# EAGLE design headphone-amp (EAGLE 9.6.2)
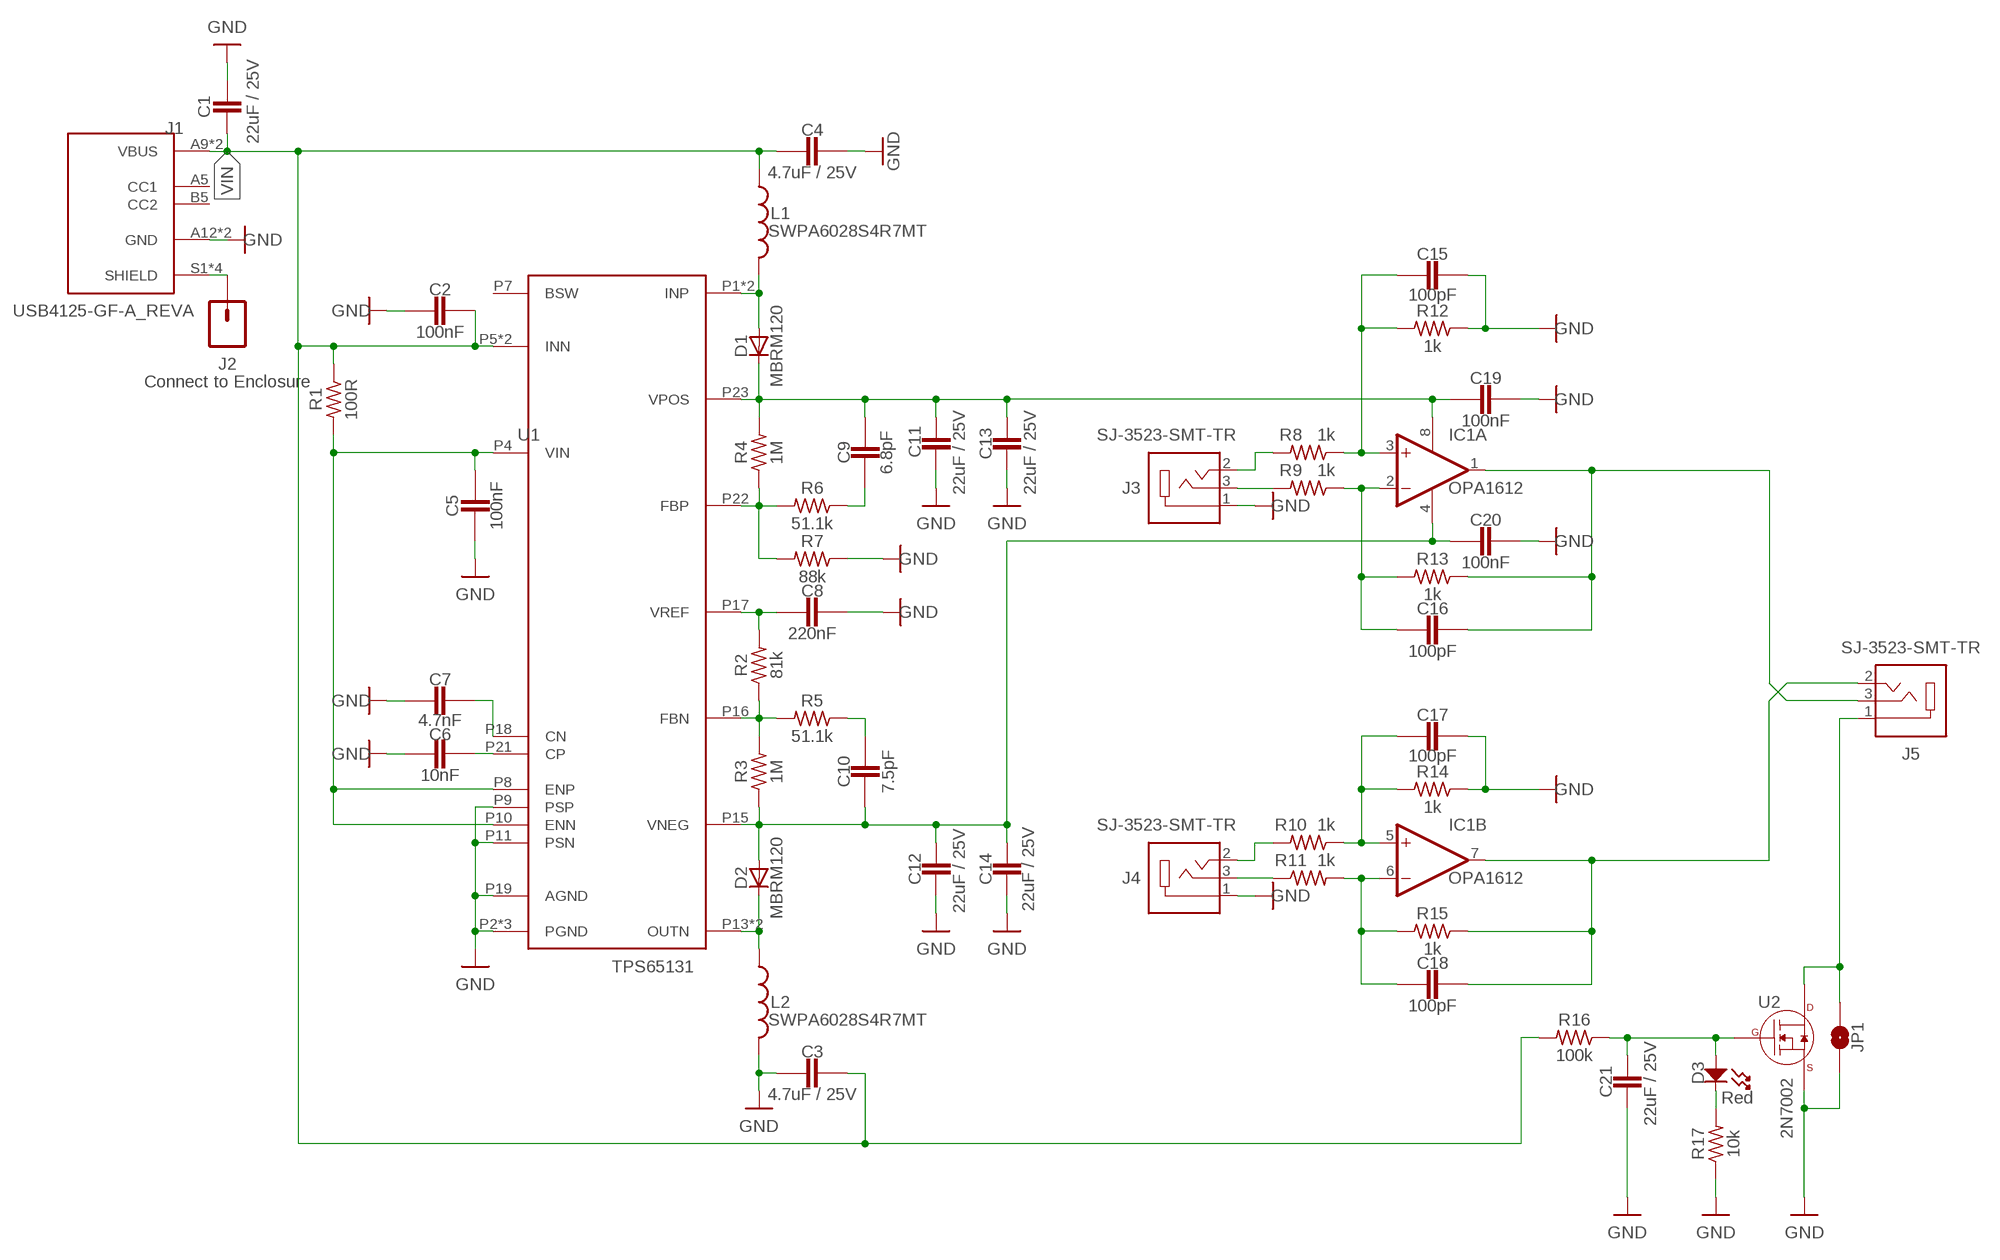
[diagram p0: schematic, sheet 1]

## Parts
C1  22uF / 25V  C-EUC0805  [C0805]
C2  100nF  CAPACITOR-0402  [C0402]
C3  4.7uF / 25V  CAPACITOR-0402  [C0402]
C4  4.7uF / 25V  CAPACITOR-0402  [C0402]
C5  100nF  CAPACITOR-0402  [C0402]
C6  10nF  CAPACITOR-0402  [C0402]
C7  4.7nF  CAPACITOR-0402  [C0402]
C8  220nF  CAPACITOR-0402  [C0402]
C9  6.8pF  CAPACITOR-0402  [C0402]
C10  7.5pF  CAPACITOR-0402  [C0402]
C11  22uF / 25V  C-EUC0805  [C0805]
C12  22uF / 25V  C-EUC0805  [C0805]
C13  22uF / 25V  C-EUC0805  [C0805]
C14  22uF / 25V  C-EUC0805  [C0805]
C15  100pF  CAPACITOR-0402  [C0402]
C16  100pF  CAPACITOR-0402  [C0402]
C17  100pF  CAPACITOR-0402  [C0402]
C18  100pF  CAPACITOR-0402  [C0402]
C19  100nF  CAPACITOR-0402  [C0402]
C20  100nF  CAPACITOR-0402  [C0402]
C21  22uF / 25V  C-EUC0805  [C0805]
D1  MBRM120  [POWERMITE]
D2  MBRM120  [POWERMITE]
D3  Red  LED_SINGLE-0603  [LED0603]
IC1  OPA1612  OPA2134UA  [SO08]
J1  USB4125-GF-A_REVA  [GCT_USB4125-GF-A_REVA]
J2  CONN_01  [1X01]
J3  SJ-3523-SMT-TR  [CUI_SJ-3523-SMT-TR]
J4  SJ-3523-SMT-TR  [CUI_SJ-3523-SMT-TR]
J5  SJ-3523-SMT-TR  [CUI_SJ-3523-SMT-TR]
JP1  JUMPER-SMT_2_NO_SILK  [SMT-JUMPER_2_NO_SILK]
L1  SWPA6028S4R7MT  L-USWE-TPC  [POWER-CHOKE_WE-TPC]
L2  SWPA6028S4R7MT  L-USWE-TPC  [POWER-CHOKE_WE-TPC]
R1  100R  R-US_R0402  [R0402]
R2  81k  R-US_R0402  [R0402]
R3  1M  R-US_R0402  [R0402]
R4  1M  R-US_R0402  [R0402]
R5  51.1k  R-US_R0402  [R0402]
R6  51.1k  R-US_R0402  [R0402]
R7  88k  R-US_R0402  [R0402]
R8  1k  R-US_R0402  [R0402]
R9  1k  R-US_R0402  [R0402]
R10  1k  R-US_R0402  [R0402]
R11  1k  R-US_R0402  [R0402]
R12  1k  R-US_R0402  [R0402]
R13  1k  R-US_R0402  [R0402]
R14  1k  R-US_R0402  [R0402]
R15  1k  R-US_R0402  [R0402]
R16  100k  R-US_R0402  [R0402]
R17  10k  R-US_R0402  [R0402]
U1  TPS65131  [QFN24-4X4-2]
U2  2N7002  N-CHANNEL_FET_SOT-23-3  [SOT-23-3]

## Nets
GND: C1.1 C2.1 C3.2 C4.1 C5.2 C6.2 C7.2 C8.1 C11.2 C12.2 C13.2 C14.2 C15.1 C17.1 C19.2 C20.2 C21.2 J1.A12(GND) J1.B12(GND) J3.1 J4.1 JP1.1 L2.2 R7.1 R12.1 R14.1 R17.1 U1.P2(PGND) U1.P3(PGND) U1.P9(PSP) U1.P11(PSN) U1.P19(AGND) U1.PAD(PGND) U2.P$2(SOURCE)
N$1: C18.1 IC1.7(B:OUT) J5.2 R15.1
N$3: D1.P$2(A) L1.2 U1.P1(INP) U1.P24(INP)
N$4: C16.1 IC1.1(A:OUT) J5.3 R13.1
N$5: J1.S1(SHIELD) J1.S2(SHIELD) J1.S3(SHIELD) J1.S4(SHIELD) J2.1
N$6: J3.3 R9.2
N$7: R4.1 R6.2 R7.2 U1.P22(FBP)
N$8: C9.2 R6.1
N$9: C8.2 R2.2 U1.P17(VREF)
N$10: R2.1 R3.2 R5.2 U1.P16(FBN)
N$11: C10.2 R5.1
N$12: J3.2 R8.2
N$13: D2.P$1(C) L2.1 U1.P13(OUTN) U1.P14(OUTN)
N$14: C6.1 U1.P21(CP)
N$15: C7.1 U1.P18(CN)
N$16: C18.2 IC1.6(B:-IN) R11.2 R15.2
N$17: C17.2 IC1.5(B:+IN) R10.1 R14.2
N$18: J4.2 R10.2
N$19: J4.3 R11.1
N$20: D3.CATHODE R17.2
N$21: C16.2 IC1.2(A:-IN) R9.1 R13.2
N$22: C15.2 IC1.3(A:+IN) R8.1 R12.2
N$23: C5.1 R1.2 U1.P4(VIN) U1.P8(ENP) U1.P10(ENN)
N$25: J5.1 JP1.2 U2.P$3(DRAIN)
N$26: C21.1 D3.ANODE R16.1 U2.P$1(GATE)
VDD: C9.1 C11.1 C13.1 C19.1 D1.P$1(C) IC1.8(A:V+) R4.2 U1.P23(VPOS)
VEE: C10.1 C12.1 C14.1 C20.1 D2.P$2(A) IC1.4(A:V-) R3.1 U1.P15(VNEG)
VIN: C1.2 C2.2 C3.1 C4.2 J1.A9(VBUS) J1.B9(VBUS) L1.1 R1.1 R16.2 U1.P5(INN) U1.P6(INN)
Unconnected: J1.A5(CC1) J1.B5(CC2) U1.P7(BSW)

## Notes on the sheet
- Connect to Enclosure

## Library data of the parts
C1 C11-C14 C21 = rcl:C-EU: CAPACITOR, European symbol; SPICEPREFIX: C
C2-C10 C15-C20 = Components:CAPACITOR
D1 D2 = sonik:MBRM120
D3 = MF_LEDs:LED_SINGLE: Library: MF_LEDs Description: Device for Single LED Packages. Manufacture part number (MFG#) can be added via Attributes.; HOUSEPART: NO; POPULATE: 1
IC1 = linear:OPA2*: Dual Operational Amplifier Low Power, Single-Supply, Rail-To-Rail Operational Amplifier Source: http://focus.ti.com/lit/ds/symlink/opa2345.pdf http://focus.ti.com .. opa241.pdf http://focus.ti.com/lit/ds/symlink/opa2134.pdf
J1 = USB4125-GF-A_REVA:USB4125-GF-A_REVA: USB 2.0 Type C Receptacle, Horizontal, SMT, For Power charging; DESCRIPTION: USB Charge Only Connector Type C Horizontal Receptacle, 3.16mm profile, 6 Pins, Surface mount, Top mount, low cost; MF: Global Connector Technology; MP: USB4125-GF-A; PACKAGE: None; PURCHASE-URL: https://pricing.snapeda.com/search/part/USB4125-GF-A/?ref=eda
J2 = SparkFun-Connectors:CONN_01: Single connection point. Often used as Generic Header-pin footprint for 0.1 inch spaced/style header connections On any of the 0.1 inch spaced packages, you can populate with these: Break Away Headers - Straight <https://www.sparkfun.com/products/116> (PRT-00116) Break Away Male Headers - Right Angle <https://www.sparkfun.com/products/553> (PRT-00553) Female Headers <https://www.sparkfun.com/products/115> (PRT-00115) Break Away Headers - Machine Pin <https://www.sparkfun.com/products/117> (PRT-00117) Break Away Female Headers - Swiss Machine Pin <https://www.sparkfun.com/products/743> (PRT-00743) This device is also useful as a general connection point to wire up your design to another part of your project. Our various solder wires solder well into these plated through hole pads. Hook-Up Wire - Assortment (Stranded, 22 AWG) <https://www.sparkfun.com/products/11375> (PRT-11375) Hook-Up Wire - Assortment (Solid Core, 22 AWG) <https://www.sparkfun.com/products/11367> (PRT-11367) View the entire wire category on our website here <https://www.sparkfun.com/categories/141> Special notes: SMTSO-256-ET is a "flush mount" nut for a 4-40 screw. We mostly use this on specialty testbeds; it is a nice way to connect hardware to your PCB at an adjustable hieght. Also note, the SNAP packages are for using a snappable style connector. We sell a baggie of snaps and they are also used on two LilyPad designs: Snap Assortment - 30 pack (male and female) <https://www.sparkfun.com/products/11347> (DEV-11347) LilyPad Arduino SimpleSnap <https://www.sparkfun.com/products/10941> (DEV-10941) LilyPad SimpleSnap Protoboard <https://www.sparkfun.com/products/10940> (DEV-10940)
J3-J5 = SJ-3523-SMT-TR:SJ-3523-SMT-TR: Audio Jack Connector 3.5 mm Low Profile Surface Mount Stereo Jack, 3 Pin Right-Angle Buy Part <https://snapeda.com/parts/SJ-3523-SMT-TR/CUI%20Devices/view-part/?ref=eda>; AVAILABILITY: Good; CUI_PURCHASE_URL: https://www.cuidevices.com/product/interconnect/connectors/audio-connectors/jacks/sj-352x-smt-series?utm_source=snapeda.com&utm_medium=referral&utm_campaign=snapedaBOM; DESCRIPTION: 3.5 mm, Stereo, Right Angle, Surface Mount (SMT), Audio Jack Connector; DIGIKEY-PURCHASE-URL: https://snapeda.com/shop?store=DigiKey&id=251570; MF: CUI Devices; MOUSER-PURCHASE-URL: https://snapeda.com/shop?store=Mouser&id=251570; MP: SJ-3523-SMT-TR; PACKAGE: LGA-10 STMicroelectronics; PRICE: None
JP1 = SparkFun-Jumpers:JUMPER-SMT_2_NO: Normally open jumper This jumper has two pads in close proximity to each other. Apply solder to close the connection. Round pads are easier to solder for beginners, but are a lot larger. SparkFun Product that uses the round pads: SparkFun EL Sequencer <https://www.sparkfun.com/products/12781>
L1 L2 = rcl:L-US: INDUCTOR, American symbol; SPICEPREFIX: L
R1-R17 = rcl:R-US_: RESISTOR, American symbol; SPICEPREFIX: R
U1 = sonik:TPS65131
U2 = MF_Discrete_Semiconductor:N-CHANNEL_FET: Library: MF_Discrete_Semiconductor Description: Device for Single N-Channel Mosfet. Manufacture part number (MFG#) can be added via Attributes.; HOUSEPART: NO; POPULATE: 1

## Board
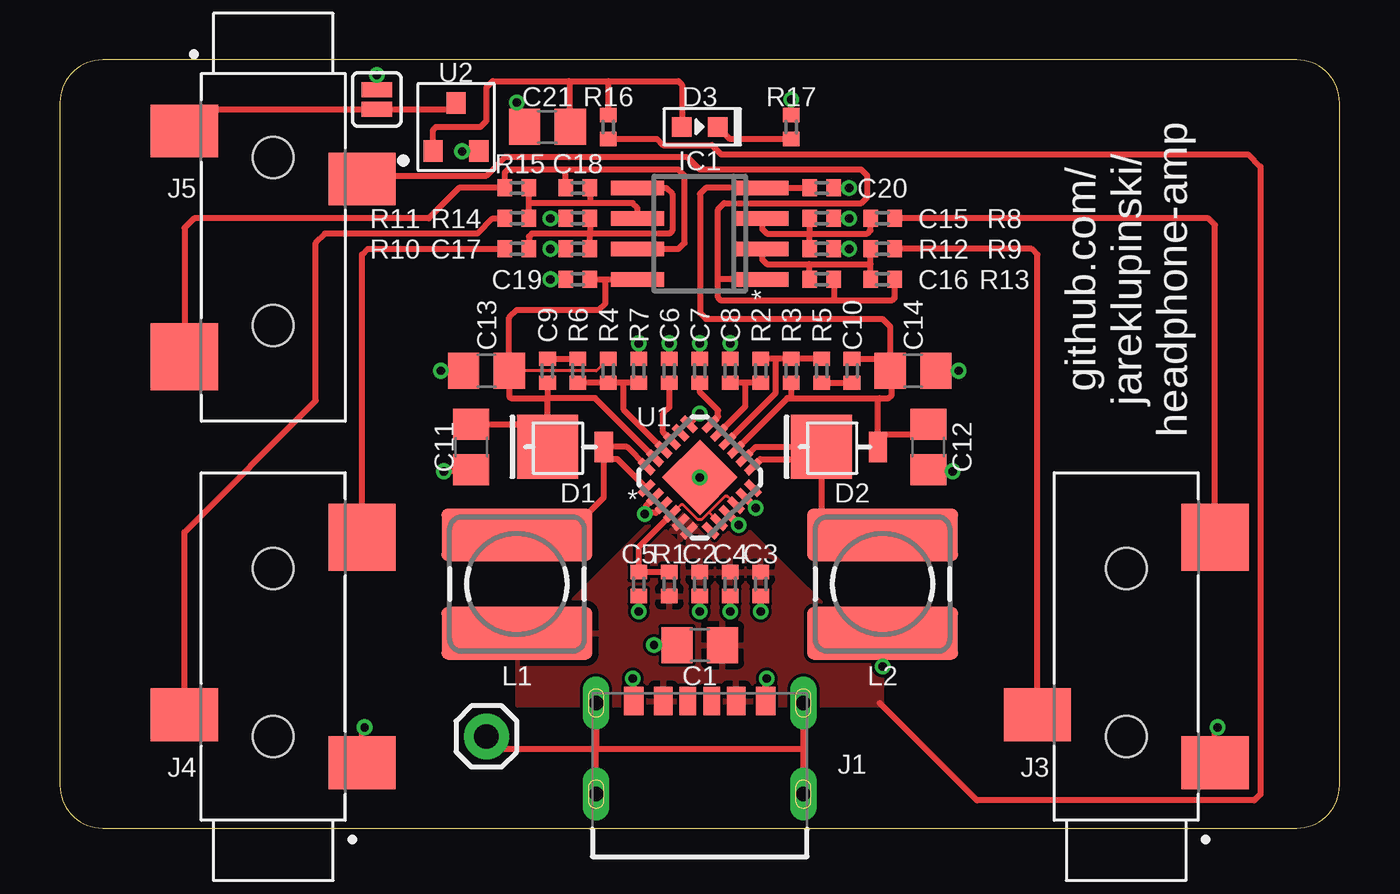
[diagram p1: board, top side]
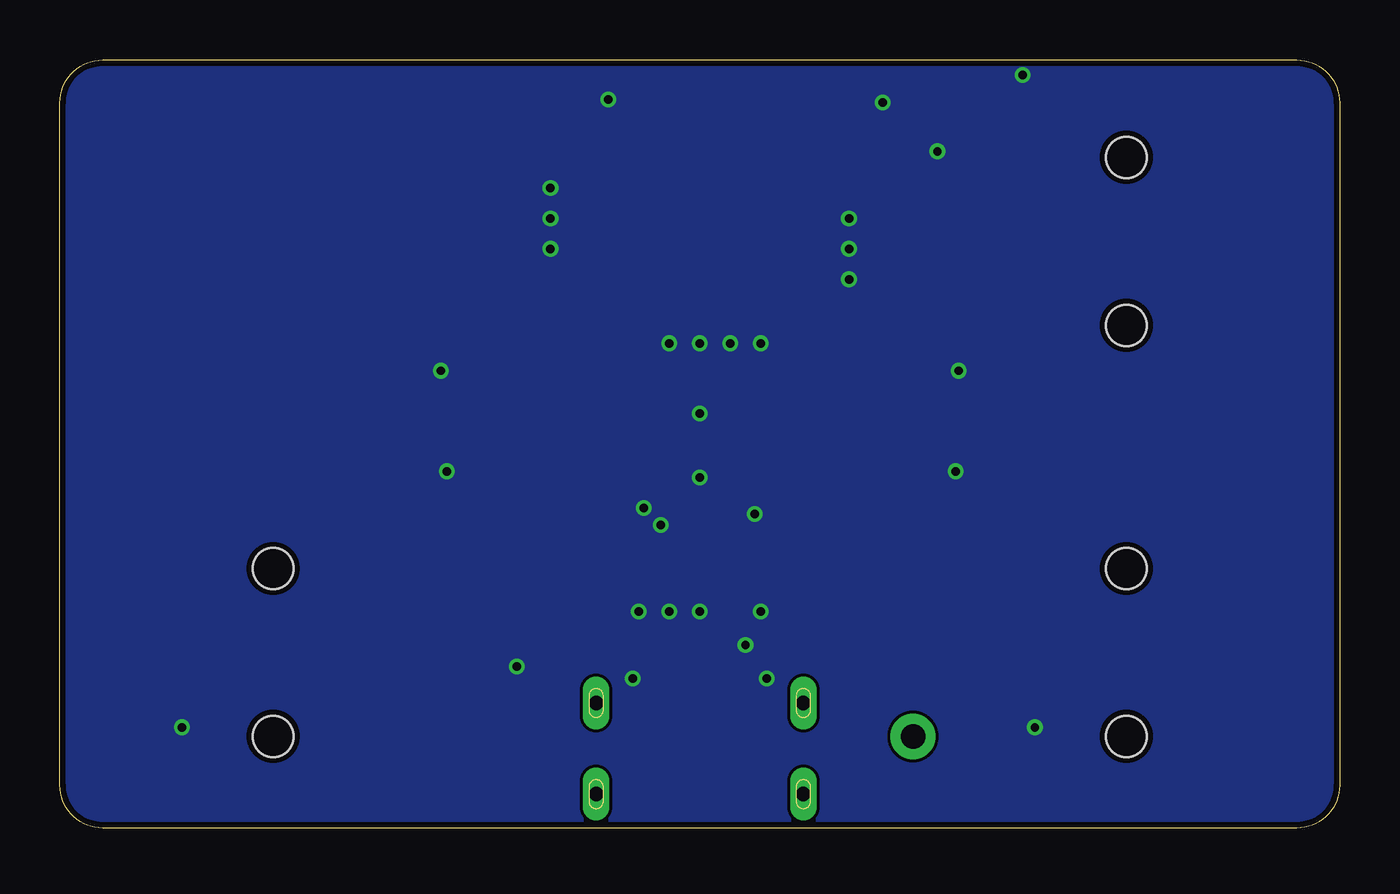
[diagram p2: board, bottom side, seen from below]

Size 53.34 x 32 mm. Coordinates in mm from the lower left corner, seen from the top.
Outline: 51.56,32 1.78,32 arc90 0,30.23 0,1.78 arc90 1.78,0 51.56,0 arc90 53.34,1.78 53.34,30.23 arc90 51.56,32
Copper layers (1*16): Top 0.035mm / dielectric 1.5mm / Bottom 0.035mm
Design rules "MF_Standard_2_Layer": minimum track width 5mil, minimum drill 12mil, track to track 5mil, track to pad 5mil, pad to pad 5mil, via to via 5mil, smd to smd 0mil, copper to edge 10mil, drill to drill 10mil, minimum pad ring 6mil, minimum via ring 6mil, stop-mask expansion 2mil, vias tented up to drill 25mil, thermal gap 10mil

### Footprints (pad centres in the part's own frame; a part is rotated, then mirrored left to right if it is on the bottom)
C0805 = smd 1.3 x 1.5: 1 -0.95,0; 2 0.95,0
C0402 = smd 0.6 x 0.7: 1 -0.5,0; 2 0.5,0
POWERMITE = smd 2.54 x 2.67: P$1 0,0 | smd 0.762 x 1.27: P$2 2.351,0
LED0603 = smd 0.8 x 0.8: ANODE 0.75,0; CATHODE -0.75,0
SO08 = smd 0.6 x 2.2: 1 -1.905,-2.6; 2 -0.635,-2.6; 3 0.635,-2.6; 4 1.905,-2.6; 5 1.905,2.6; 6 0.635,2.6; 7 -0.635,2.6; 8 -1.905,2.6
GCT_USB4125-GF-A_REVA = smd 0.7 x 1.2: A5 -0.5,0.08; B5 0.5,0.08 | smd 0.76 x 1.2: A9 1.52,0.08; B9 -1.52,0.08 | smd 0.8 x 1.2: A12 2.75,0.08; B12 -2.75,0.08 | drill 0.6 pad 1.1 long: S1 -4.32,0; S2 4.32,0; S3 -4.32,-3.8; S4 4.32,-3.8
1X01 = drill 1.016 pad 1.88: 1 0,0
CUI_SJ-3523-SMT-TR = smd 2.2 x 2.8: 1 -1.1,-3.7; 3 0.9,3.7 | smd 2.8 x 2.8: 2 8.3,-3.7 | hole 1.7: 0,0; 7,0
SMT-JUMPER_2_NO_SILK = smd 0.635 x 1.27: 1 -0.406,0; 2 0.406,0
POWER-CHOKE_WE-TPC = smd 6.3 x 2.2: 1 0,2.05; 2 0,-2.05
R0402 = smd 0.6 x 0.7: 1 -0.5,0; 2 0.5,0
QFN24-4X4-2 = smd 0.75 x 0.3: P1 -1.885,1.25; P2 -1.885,0.75; P3 -1.885,0.25; P4 -1.885,-0.25; P5 -1.885,-0.75; P6 -1.885,-1.25; P13 1.885,-1.25; P14 1.885,-0.75; P15 1.885,-0.25; P16 1.885,0.25; P17 1.885,0.75; P18 1.885,1.25 | smd 0.3 x 0.75: P7 -1.25,-1.885; P8 -0.75,-1.885; P9 -0.25,-1.885; P10 0.25,-1.885; P11 0.75,-1.885; P12 1.25,-1.885; P19 1.25,1.885; P20 0.75,1.885; P21 0.25,1.885; P22 -0.25,1.885; P23 -0.75,1.885; P24 -1.25,1.885 | smd 2.22 x 2.22: PAD 0,0
SOT-23-3 = smd 0.9 x 0.8: P$1 -1,0.95; P$2 -1,-0.95; P$3 1,0

### Placement (x,y rotation side)
C1  26.67,7.62 0 top
C2  26.67,10.16 90 top
C3  29.21,10.16 270 top
C4  27.94,10.16 90 top
C5  24.13,10.16 270 top
C6  25.4,19.05 90 top
C7  26.67,19.05 90 top
C8  27.94,19.05 270 top
C9  20.32,19.05 90 top
C10  33.02,19.05 270 top
C11  17.14,15.88 270 top
C12  36.2,15.88 270 top
C13  17.78,19.05 180 top
C14  35.56,19.05 0 top
C15  31.75,25.4 180 top
C16  31.75,22.86 180 top
C17  21.59,24.13 0 top
C18  21.59,26.67 0 top
C19  21.59,22.86 180 top
C20  31.75,26.67 0 top
C21  20.32,29.21 180 top
D1  20.32,15.88 0 top
D2  31.75,15.88 0 top
D3  26.67,29.21 180 top
IC1  26.67,24.77 90 top
J1  26.67,5.21 0 top
J2  17.78,3.81 0 top
J3  44.45,3.81 90 top
J4  8.89,3.81 90 top
J5  8.89,27.94 270 top
JP1  13.21,30.36 270 top
L1  19.05,10.16 180 top
L2  34.29,10.16 0 top
R1  25.4,10.16 90 top
R2  29.21,19.05 270 top
R3  30.48,19.05 90 top
R4  22.86,19.05 90 top
R5  31.75,19.05 90 top
R6  21.59,19.05 270 top
R7  24.13,19.05 270 top
R8  34.29,25.4 0 top
R9  34.29,24.13 0 top
R10  19.05,24.13 180 top
R11  19.05,25.4 0 top
R12  31.75,24.13 180 top
R13  34.29,22.86 180 top
R14  21.59,25.4 0 top
R15  19.05,26.67 0 top
R16  22.86,29.21 270 top
R17  30.48,29.21 270 top
U1  26.67,14.61 45 top
U2  16.51,29.21 90 top

### Tracks (layer width: path | path; a pad name or v marks a point on that pad's centre or on a via)
GND  (via drill 0.35)
  Top 0.254: C2.1 v26.67,9.02 | C4.1 v27.94,9.02 | C5.2 v24.13,9.02 | U1.P9 v28.3,12.63 | U1.P11 v29,13.33 | U1.P2 24.43,13.42 24.43,13.13 | 24.43,13.13 v24.38,13.08 | U1.P3 24.83,13.13 24.43,13.13 | C3.2 v29.21,9.02 | C1.1 v24.77,7.62 | J1.B12 23.92,6.18 v23.88,6.23 | J1.A12 29.42,6.18 v29.46,6.23 | L2.2 v34.29,6.73 | J3.1 48.15,4.08 v48.26,4.19 | J4.1 12.59,4.08 v12.7,4.19 | C11.2 17.08,14.86 v16,14.86 | v37.21,14.86 36.26,14.86 C12.2 | U1.P19 v26.67,17.28 | R7.1 v24.13,20.2 | C6.2 v25.4,20.2 | C7.2 v26.67,20.2 | C8.1 v27.94,20.2 | R14.1 v20.45,25.4 | C17.1 v20.45,24.13 | C19.2 v20.45,22.86 | C15.1 v32.89,25.4 | R12.1 v32.89,24.13 | C20.2 v32.89,26.67 | C21.2 19.05,29.53 v19.05,30.23 | U2.P$2 17.44,28.2 v16.76,28.2 | R17.1 v30.48,30.36 | JP1.1 v13.21,31.37 | C13.2 v15.88,19.05 | C14.2 v37.47,19.05
  other vias: 26.67,14.61
  pour Bottom: 0,32 0,0 54,0 54,32
N$1
  Top 0.254: IC1.7 25.78,24.13 26.04,24.39 26.04,27.18 25.78,27.44 21.08,27.44 | 21.08,27.44 18.67,27.44 18.54,27.31 R15.1 16.64,26.67 15.37,25.4 5.59,25.4 5.19,25.01 J5.2 | C18.1 21.08,27.44
N$3
  Top 0.254: U1.P1 23.24,15.37 22.67,15.37 | L1.2 21.1,12.21 22.67,13.79 22.67,15.37 | 22.67,15.37 D1.P$2 23.63,15.88 U1.P24
N$4
  Top 0.254: IC1.1 27.43,22.86 | 27.43,22.86 27.43,25.79 27.69,26.04 33.4,26.04 33.66,26.29 33.66,27.18 33.4,27.44 26.67,27.44 26.16,27.94 18.54,27.94 17.78,27.18 12.73,27.18 J5.3 | R13.1 34.79,22.09 34.67,21.98 32.26,21.98 | 32.26,21.98 27.56,21.98 27.43,22.1 27.43,22.86 | C16.1 32.26,21.98
N$5
  Top 0.254: J2.1 18.29,3.31 22.35,3.31 | 22.35,3.31 30.99,3.31 | 30.99,3.31 J1.S2 | J1.S4 30.99,3.3 30.99,3.31 | J1.S1 22.35,3.31 | J1.S3 22.35,3.3 22.35,3.31
N$6
  Top 0.254: R9.2 40.51,24.13 40.75,23.9 J3.3
N$7
  Top 0.254: R7.2 23.5,18.55 | 23.5,18.55 R4.1 R6.2 | U1.P22 23.5,17.43 23.5,18.55
N$8
  Top 0.254: C9.2 R6.1
N$9
  Top 0.254: R2.2 28.57,18.55 | 28.57,18.55 C8.2 | U1.P17 28.57,17.58 28.57,18.55
N$10
  Top 0.254: R5.2 R3.2 29.84,19.55 | 29.84,19.55 R2.1 | U1.P16 29.84,18.14 29.84,19.55
N$11
  Top 0.254: R5.1 C10.2
N$12
  Top 0.254: J3.2 48.15,25.13 47.88,25.4 R8.2
N$13
  Top 0.254: U1.P14 29,15.88 31.11,15.88 | 31.11,15.88 D2.P$1 31.75,12.7 32.24,12.21 L2.1 | U1.P13 29.2,15.37 30.99,15.37 31.11,15.5 31.11,15.88
N$14
  Top 0.254: U1.P21 25.15,16.49 25.15,17.28 25.4,17.53 C6.1
N$15
  Top 0.254: U1.P18 27.43,17.14 27.43,17.4 26.67,18.17 C7.1
N$16
  Top 0.254: IC1.6 24.07,25.85 23.88,26.04 22.1,26.04 | 22.1,26.04 19.56,26.04 | 19.56,26.04 19.55,26.05 R15.2 | R11.2 19.55,26.03 19.56,26.04 | C18.2 22.1,26.04
N$17
  Top 0.254: IC1.5 25.27,26.67 25.53,26.42 25.53,24.9 25.4,24.77 22.1,24.77 | R10.1 19.55,24.64 19.68,24.77 22.1,24.77 | R14.2 22.1,24.77 | C17.2 22.09,24.76 22.1,24.77
N$18
  Top 0.254: J4.2 12.59,23.9 12.83,24.13 R10.2
N$19
  Top 0.254: J4.3 5.19,12.33 10.67,17.81 10.67,24.39 11.05,24.77 17.41,24.77 18.04,25.4 R11.1
N$20
  Top 0.254: D3.CATHODE 27.91,28.73 27.94,28.71 R17.2
N$21
  Top 0.254: IC1.2 29.27,23.69 29.46,23.5 31.24,23.5 | 31.24,23.5 33.78,23.5 | 33.78,23.5 33.79,23.51 R9.1 | R13.2 33.78,23.5 | C16.2 31.25,23.49 31.24,23.5
N$22
  Top 0.254: IC1.3 29.27,24.96 29.46,24.77 31.24,24.77 | 31.24,24.77 33.66,24.77 33.79,24.9 R8.1 | R12.2 31.25,24.76 31.24,24.77 | C15.2 31.25,24.78 31.24,24.77
N$23
  Top 0.127: 27.06,13.16 26.75,12.85 26.59,12.85 25.97,13.47 25.88,13.47 U1.P4 | U1.P10 27.82,13.82 27.72,13.82 27.06,13.16 | U1.P8 27.06,13.16 | 27.06,13.16
  Top 0.254: U1.P4 24.13,11.71 C5.1 R1.2
N$25
  Top 0.254: J5.1 6.1,29.95 JP1.2 16.25,29.95 U2.P$3
N$26
  Top 0.254: U2.P$1 15.56,29.1 15.67,29.21 17.53,29.21 17.78,29.47 17.78,30.87 18.03,31.12 21.21,31.12 | D3.ANODE 25.92,30.98 25.78,31.12 22.86,31.12 | 21.21,31.12 22.86,31.12 | C21.1 21.27,31.06 21.21,31.12 | R16.1 22.86,31.12
VDD
  Top 0.127: R4.2 22.36,19.05 C13.1
  Top 0.254: U1.P23 22.31,17.91 20.32,17.91 | C9.1 20.32,17.91 | D1.P$1 20.32,16.51 | 20.32,16.51 20.32,17.91 | C19.1 22.73,22.86 | 22.73,22.86 IC1.8 | 22.73,22.86 22.73,21.85 22.48,21.59 19.05,21.59 18.73,21.27 C13.1 18.73,17.98 18.8,17.91 20.32,17.91 | C11.1 20,16.83 20.32,16.51
VEE
  Top 0.254: U1.P15 30.33,17.91 30.48,17.91 | C14.1 34.67,18.99 34.67,18.04 34.54,17.91 34.16,17.91 | R3.1 30.48,17.91 | C10.1 34.11,19.55 C14.1 | C20.1 IC1.4 26.92,26.67 26.67,26.42 26.67,21.47 26.92,21.21 34.3,21.21 34.61,20.9 C14.1 | 30.48,17.91 34.16,17.91 | D2.P$2 34.1,16.39 | 34.1,16.39 34.1,17.85 34.16,17.91 | C12.1 35.75,16.39 34.1,16.39
VIN
  Top 0.254: R16.2 24.88,28.71 25.15,28.45 27.18,28.45 27.56,28.07 49.53,28.07 50.04,27.56 50.04,1.4 49.78,1.15 38.23,1.15 34.16,5.21
  pour Top: 19.05,5.08 34.29,5.08 34.29,6.86 28,13.15 25,13.15 19.05,7.2

### Text on the board
tPlace: github.com/ / jareklupinski/ / headphone-amp | * | *